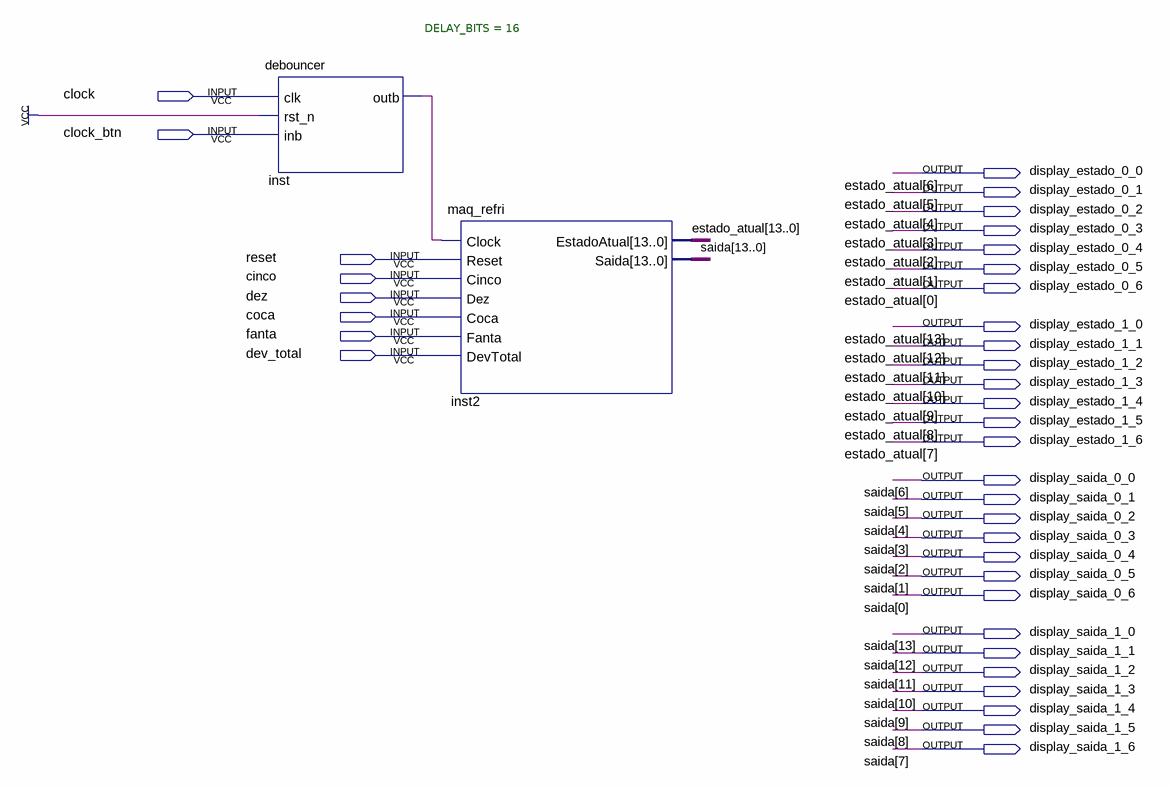
[diagram p0: schematic sheet]
// Quartus schematic mf.bdf as structural Verilog: 2 symbols, 36 pins
module mf (
  input  clock,
  input  clock_btn,
  input  reset,
  input  cinco,
  input  dez,
  input  coca,
  input  fanta,
  input  dev_total,
  output display_estado_0_0,
  output display_estado_0_1,
  output display_estado_0_2,
  output display_estado_0_3,
  output display_estado_0_4,
  output display_estado_0_5,
  output display_estado_0_6,
  output display_estado_1_0,
  output display_estado_1_1,
  output display_estado_1_2,
  output display_estado_1_3,
  output display_estado_1_4,
  output display_estado_1_5,
  output display_estado_1_6,
  output display_saida_0_0,
  output display_saida_0_1,
  output display_saida_0_2,
  output display_saida_0_3,
  output display_saida_0_4,
  output display_saida_0_5,
  output display_saida_0_6,
  output display_saida_1_0,
  output display_saida_1_1,
  output display_saida_1_2,
  output display_saida_1_3,
  output display_saida_1_4,
  output display_saida_1_5,
  output display_saida_1_6
);

  wire inst_outb;

  debouncer #(.DELAY_BITS(16)) inst (.clk(clock), .rst_n(1'b1), .inb(clock_btn), .outb(inst_outb));
  maq_refri inst2 (
    .Clock(inst_outb), .Reset(reset), .Cinco(cinco), .Dez(dez), .Coca(coca), .Fanta(fanta),
    .DevTotal(dev_total),
    .EstadoAtual({display_estado_1_0, display_estado_1_1, display_estado_1_2, display_estado_1_3, display_estado_1_4, display_estado_1_5, display_estado_1_6, display_estado_0_0, display_estado_0_1, display_estado_0_2, display_estado_0_3, display_estado_0_4, display_estado_0_5, display_estado_0_6}),
    .Saida({display_saida_1_0, display_saida_1_1, display_saida_1_2, display_saida_1_3, display_saida_1_4, display_saida_1_5, display_saida_1_6, display_saida_0_0, display_saida_0_1, display_saida_0_2, display_saida_0_3, display_saida_0_4, display_saida_0_5, display_saida_0_6}));

  // Other names for the same wires on the sheet: estado_atual[13:0] = {display_estado_1_0, display_estado_1_1, display_estado_1_2, display_estado_1_3, display_estado_1_4, display_estado_1_5, display_estado_1_6, display_estado_0_0, display_estado_0_1, display_estado_0_2, display_estado_0_3, display_estado_0_4, display_estado_0_5, display_estado_0_6};
  //   saida[13:0] = {display_saida_1_0, display_saida_1_1, display_saida_1_2, display_saida_1_3, display_saida_1_4, display_saida_1_5, display_saida_1_6, display_saida_0_0, display_saida_0_1, display_saida_0_2, display_saida_0_3, display_saida_0_4, display_saida_0_5, display_saida_0_6}
endmodule
